# Altium project Teste_Altium.PrjPcb
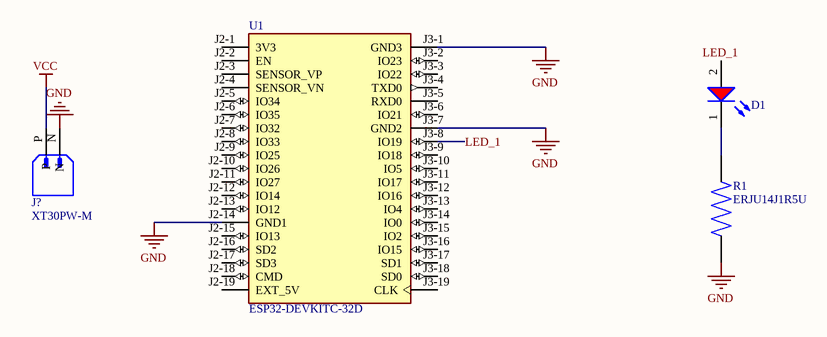
[diagram p0: Teste_Altium.SchDoc]
1 sheet, 4 parts. Net scope: global (net labels, ports and power ports of the same name join across sheets).

## Sheet Teste_Altium.SchDoc
size A4; SheetNumber: 1; SheetTotal: 1

### Parts
D1  Red, 1.9V, 30°  [WL-TMRW_D3.9H5.3]  (value not drawn)
J?  XT30PW-M  [AMASS_XT30PW-M]
R1  ERJU14J1R5U  [RES_ERJU14J1R5U]
U1  ESP32-DEVKITC-32D  [MODULE_ESP32-DEVKITC-32D]

### Nets
GND: J?.N R1.1 U1.J2-14(GND1) U1.J3-1(GND3) U1.J3-7(GND2)
VCC: J?.P
LED_1: D1.2(A) U1.J3-8(IO19)
NetD1_1: D1.1(K) R1.2

Not connected (* = marked no-connect by the designer): U1 J2-1(3V3) J2-2(EN) J2-3(SENSOR_VP) J2-4(SENSOR_VN) J2-5(IO34) J2-6(IO35) J2-7(IO32) J2-8(IO33) J2-9(IO25) J2-10(IO26) J2-11(IO27) J2-12(IO14) J2-13(IO12) J2-15(IO13) J2-16(SD2) J2-17(SD3) J2-18(CMD) J2-19(EXT_5V) J3-2(IO23) J3-3(IO22) J3-4(TXD0) J3-5(RXD0) J3-6(IO21) J3-9(IO18) J3-10(IO5) J3-11(IO17) J3-12(IO16) J3-13(IO4) J3-14(IO0) J3-15(IO2) J3-16(IO15) J3-17(SD1) J3-18(SD0) J3-19(CLK)

### Library data of the parts
D1 = 151053RS03000: WL-TMRW Mono-color Round Waterclear, THT, D5.8 x H11.7mm, Red, 1.9V, 30°; Manufacturer: Wurth Elektronik; Chip Technology: AlInGaP; Dominant Wavelength: 623nm; Luminous Intensity: 5000mcd; Peak Wavelength: 631nm; Manufacturer Part Number: 151053RS03000; Category: Signal LEDs; Match Code: WL-TMRW; ComponentLink1Description: Website Link; ComponentLink1URL: https://www.we-online.com/redexpert/article/151053RS03000?ad; ComponentLink2Description: Datasheet Link; ComponentLink2URL: https://www.we-online.com/redexpert/spec/151053RS03000?ad; Mount: Through Hole; Operating Temperature Max: 85°C; Operating Temperature Min: -40°C; Packaging: Bulk; Height: 11.7mm; Diameter: 5.8mm; Emitting Color: Red; Forward Voltage: 1.9V; Viewing Angle: 30°
J? = XT30PW-M: Socket; DC supply; XT30; male; PIN: 2; on PCBs; THT; Colour: yellow; MF: AMASS; SnapEDA_Link: https://www.snapeda.com/parts/XT30PW-M/AMASS/view-part/?ref=snap; Package: None; Value: *; MP: XT30PW-M; Check_prices: https://www.snapeda.com/parts/XT30PW-M/AMASS/view-part/?ref=eda
R1 = ERJU14J1R5U: 1210 anti-sulfurated resistor 1210 Anti-Sulfurated; MP: ERJ-U14J1R5U; MF: Panasonic; Value: *; SnapEDA_Link: https://www.snapeda.com/parts/ERJ-U14J1R5U/Panasonic/view-part/?ref=snap; Purchase-URL: https://pricing.snapeda.com/search/part/ERJ-U14J1R5U/?ref=eda; Check_prices: https://www.snapeda.com/parts/ERJ-U14J1R5U/Panasonic/view-part/?ref=eda; Availability: In Stock; Price: None; Package: 3225-2 Panasonic
U1 = ESP32-DEVKITC-32D: WiFi Development Tools (802.11) ESP32 General Development Kit, ESP32-WROOM-32D on the board; MF: Espressif Systems; SnapEDA_Link: https://www.snapeda.com/parts/ESP32-DEVKITC-32D/Espressif+Systems/view-part/?ref=snap; Package: None; Value: *; MP: ESP32-DEVKITC-32D; Check_prices: https://www.snapeda.com/parts/ESP32-DEVKITC-32D/Espressif+Systems/view-part/?ref=eda